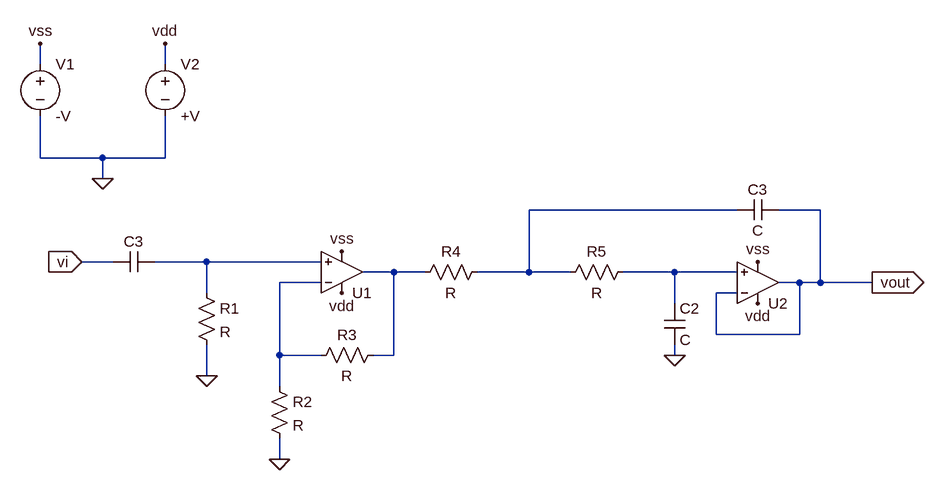
[diagram p0: schematic Draft2.asc]
Draft2.asc, the LTspice schematic file:
Version 4
SHEET 1 1312 680
WIRE -64 -192 -64 -224
WIRE 128 -192 128 -224
WIRE -64 -48 -64 -112
WIRE 32 -48 -64 -48
WIRE 128 -48 128 -112
WIRE 128 -48 32 -48
WIRE 32 -16 32 -48
WIRE 1008 32 688 32
WIRE 1136 32 1072 32
WIRE 48 112 0 112
WIRE 192 112 112 112
WIRE 368 112 192 112
WIRE 480 128 432 128
WIRE 528 128 480 128
WIRE 688 128 688 32
WIRE 688 128 608 128
WIRE 752 128 688 128
WIRE 912 128 832 128
WIRE 1008 128 912 128
WIRE 368 144 304 144
WIRE 1104 144 1072 144
WIRE 1136 144 1136 32
WIRE 1136 144 1104 144
WIRE 1216 144 1136 144
WIRE 192 160 192 112
WIRE 1008 160 976 160
WIRE 912 176 912 128
WIRE 976 224 976 160
WIRE 1104 224 1104 144
WIRE 1104 224 976 224
WIRE 304 256 304 144
WIRE 368 256 304 256
WIRE 480 256 480 128
WIRE 480 256 448 256
WIRE 912 256 912 240
WIRE 192 288 192 240
WIRE 304 304 304 256
WIRE 304 416 304 384
FLAG 912 256 0
FLAG 304 416 0
FLAG 192 288 0
FLAG 0 112 vi
IOPIN 0 112 In
FLAG 1216 144 vout
IOPIN 1216 144 Out
FLAG 400 96 vss
FLAG 1040 112 vss
FLAG 400 160 vdd
FLAG 1040 176 vdd
FLAG -64 -224 vss
FLAG 128 -224 vdd
FLAG 32 -16 0
SYMBOL cap 112 96 R90
WINDOW 0 0 32 VBottom 2
WINDOW 3 32 32 VTop 2
SYMATTR InstName C3
SYMATTR Value ""
SYMBOL res 176 144 R0
SYMATTR InstName R1
SYMBOL OpAmps\\UniversalOpAmp2 400 128 M180
SYMATTR InstName U1
SYMBOL res 288 288 R0
SYMATTR InstName R2
SYMBOL res 464 240 R90
WINDOW 0 0 56 VBottom 2
WINDOW 3 32 56 VTop 2
SYMATTR InstName R3
SYMBOL res 624 112 R90
WINDOW 0 0 56 VBottom 2
WINDOW 3 32 56 VTop 2
SYMATTR InstName R4
SYMBOL res 848 112 R90
WINDOW 0 0 56 VBottom 2
WINDOW 3 32 56 VTop 2
SYMATTR InstName R5
SYMBOL cap 896 176 R0
SYMATTR InstName C2
SYMBOL cap 1072 16 R90
WINDOW 0 0 32 VBottom 2
WINDOW 3 32 32 VTop 2
SYMATTR InstName C3
SYMBOL OpAmps\\UniversalOpAmp2 1040 144 M180
SYMATTR InstName U2
SYMBOL voltage -64 -208 R0
SYMATTR InstName V1
SYMATTR Value -V
SYMBOL voltage 128 -208 R0
SYMATTR InstName V2
SYMATTR Value +V

The netlist it stands for:
* Draft2.asc
C3 N002 vi
R1 N002 0 R
XU1 N002 N005 vdd vss N003 level2 Avol=1Meg GBW=10Meg Slew=10Meg Ilimit=25m Rail=0 Vos=0 En=0 Enk=0 In=0 Ink=0 Rin=500Meg  ; pins In+ In- V+ V- OUT
R2 N005 0 R
R3 N003 N005 R
R4 N001 N003 R
R5 N004 N001 R
C2 N004 0 C
C3 vout N001 C
XU2 N004 vout vdd vss vout level2 Avol=1Meg GBW=10Meg Slew=10Meg Ilimit=25m Rail=0 Vos=0 En=0 Enk=0 In=0 Ink=0 Rin=500Meg  ; pins In+ In- V+ V- OUT
V1 vss 0 -V
V2 vdd 0 +V
.lib UniversalOpAmp2.lib
.backanno
.end